# Altium schematic sheet Power_Supply.SchDoc
size A; SheetNumber: 1; SheetTotal: 4
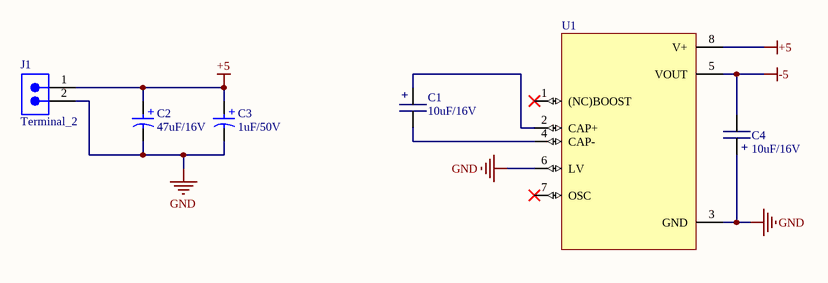
[diagram p0: Power_Supply.SchDoc]

## Parts
C1  10uF/16V  [TANTALUM SMD C]
C2  47uF/16V  [WCAP-ASLI_D5H5.5]
C3  1uF/50V  [WCAP-ASLI_D5H5.5]
C4  10uF/16V  [TANTALUM SMD C]
J1  Terminal_2  [TBL_2_3_81]
U1  (no value)  [SOIC127P600X175-8N]

## Nets
+5: C2.1(P) C3.1(P) J1.1 U1.8(V+)
-5: C4.1 U1.5(VOUT)
GND: C2.2(N) C3.2(N) C4.2 J1.2 U1.3(GND) U1.6(LV)
NetC1_1: C1.1 U1.4(CAP-)
NetC1_2: C1.2 U1.2(CAP+)

Not connected (* = marked no-connect by the designer): U1 1((NC)BOOST)* 7(OSC)*

## Notes on the sheet
- (in symbol Capacitor_Polarized_AL) +
- (in symbol Capacitor_Polarized_TA) +

## Library data of the parts
C1 C4 = Capacitor_Polarized_TA: Size: 2312; URL: https://www.thegioiic.com/tu-tantalum-10uf-16v-2312-tajc106k016rnj; Value: 10uF/16V
C2 C3 = Capacitor_Polarized_AL
  C2: Size: 5x5.4mm; URL: https://www.thegioiic.com/tu-nhom-smd-47uf-16v-5x5-4mm; Value: 47uF/16V
  C3: Size: 4x5.4mm; URL: https://www.thegioiic.com/tu-nhom-smd-1uf-50v-4x5-4mm; Value: 1uF/50V
J1 = Terminal_2: Value: 20A, 300V
U1 = ICL7662CBA-T: Size: 8-SOIC; Value: ICL7662CBA; URL: https://www.thegioiic.com/icl7662cba